# EAGLE schematic PRoMo_Base_DIP v1.1 (EAGLE 7.3.0)
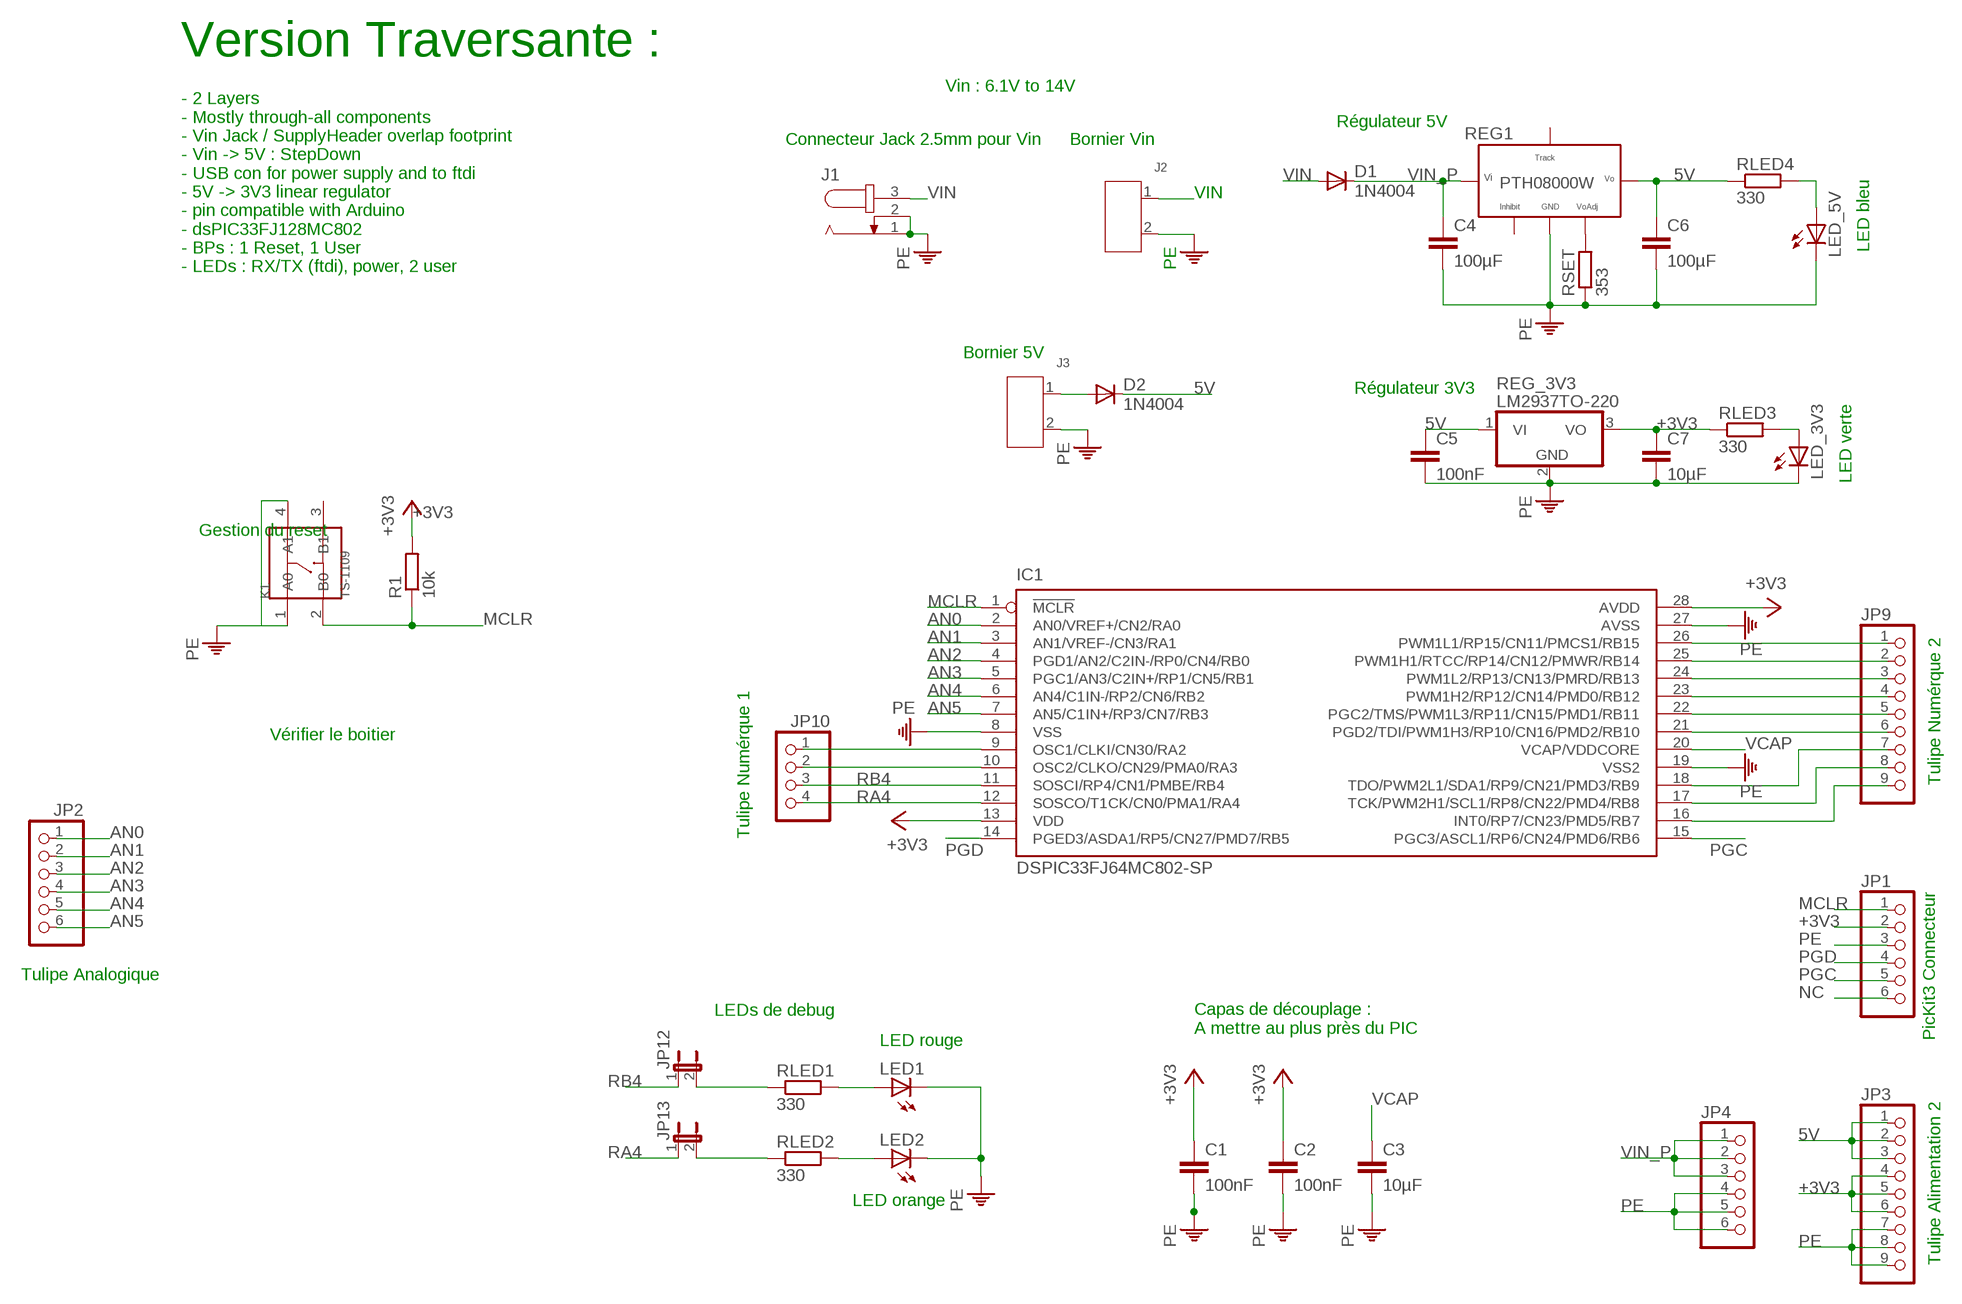
[diagram p0: schematic, sheet 1]

## Parts
C1  100nF  C-EU102-043X133  [C102-043X133]
C2  100nF  C-EU050-035X075  [C050-035X075]
C3  10µF  C-EU050-035X075  [C050-035X075]
C4  100µF  C-EU050-035X075  [C050-035X075]
C5  100nF  C-EU050-035X075  [C050-035X075]
C6  100µF  C-EU050-035X075  [C050-035X075]
C7  10µF  C-EU050-035X075  [C050-035X075]
D1  1N4004  [DO41-10]
D2  1N4004  [DO41-10]
IC1  DSPIC33FJ64MC802-SP  [DIL28-3]
J1  JACK-PLUG1  [SPC4078]
J2  SCREW-TERMINAL-GREEN(2P-5.0)  [H2-5.0-10.5X8.0MM]
J3  SCREW-TERMINAL-GREEN(2P-5.0)  [H2-5.0-10.5X8.0MM]
JP1  PINHD-1X6/90  [1X06/90]
JP2  PINHD-1X6  [1X06]
JP3  PINHD-1X9  [1X09]
JP4  PINHD-1X6  [1X06]
JP9  PINHD-1X9  [1X09]
JP10  PINHD-1X4  [1X04]
JP12  JP1E  [JP1]
JP13  JP1E  [JP1]
K1  TS-1109  DIP-BUTTON-4P  [SW4-6.0X6.0X5.0MM]
LED1  LED3MM  [LED3MM]
LED2  LED3MM  [LED3MM]
LED_3V3  LED3MM  [LED3MM]
LED_5V  LED3MM  [LED3MM]
R1  10k  R-EU_0207/10  [0207/10]
REG1  PTH08000W(EUS)  [TRHOUGH_HOLE_(EUS)]
REG_3V3  LM2937TO-220  [TO220V]
RLED1  330  R-EU_0207/10  [0207/10]
RLED2  330  R-EU_0207/10  [0207/10]
RLED3  330  R-EU_0207/10  [0207/10]
RLED4  330  R-EU_0207/10  [0207/10]
RSET  353  R-EU_0207/10  [0207/10]

## Nets
5V: C5.1 C6.1 D2.C JP3.1 JP3.2 JP3.3 REG1.6 REG_3V3.1(VI) RLED4.1
+3V3: C1.1 C2.1 C7.1 IC1.13(VDD) IC1.28(AVDD) JP1.2 JP3.4 JP3.5 JP3.6 R1.2 REG_3V3.3(VO) RLED3.1
AN0: IC1.2(AN0/VREF+/CN2/RA0) JP2.1
AN1: IC1.3(AN1/VREF-/CN3/RA1) JP2.2
AN2: IC1.4(PGD1/AN2/C2IN-/RP0/CN4/RB0) JP2.3
AN3: IC1.5(PGC1/AN3/C2IN+/RP1/CN5/RB1) JP2.4
AN4: IC1.6(AN4/C1IN-/RP2/CN6/RB2) JP2.5
AN5: IC1.7(AN5/C1IN+/RP3/CN7/RB3) JP2.6
MCLR: IC1.1(!MCLR) JP1.1 K1.2(B0) R1.1
N$1: IC1.26(PWM1L1/RP15/CN11/PMCS1/RB15) JP9.1
N$2: IC1.25(PWM1H1/RTCC/RP14/CN12/PMWR/RB14) JP9.2
N$3: IC1.24(PWM1L2/RP13/CN13/PMRD/RB13) JP9.3
N$4: IC1.23(PWM1H2/RP12/CN14/PMD0/RB12) JP9.4
N$5: IC1.22(PGC2/TMS/PWM1L3/RP11/CN15/PMD1/RB11) JP9.5
N$6: IC1.21(PGD2/TDI/PWM1H3/RP10/CN16/PMD2/RB10) JP9.6
N$7: IC1.18(TDO/PWM2L1/SDA1/RP9/CN21/PMD3/RB9) JP9.7
N$8: IC1.17(TCK/PWM2H1/SCL1/RP8/CN22/PMD4/RB8) JP9.8
N$9: IC1.16(INT0/RP7/CN23/PMD5/RB7) JP9.9
N$10: IC1.9(OSC1/CLKI/CN30/RA2) JP10.1
N$11: IC1.10(OSC2/CLKO/CN29/PMA0/RA3) JP10.2
N$12: LED2.A RLED2.2
N$13: LED1.A RLED1.2
N$14: LED_3V3.A RLED3.2
N$15: JP12.2 RLED1.1
N$16: JP13.2 RLED2.1
N$17: D2.A J3.1
N$20: REG1.5 RSET.2
N$21: LED_5V.A RLED4.2
NC: JP1.6
PE: C1.2 C2.2 C3.2 C4.2 C5.2 C6.2 C7.2 IC1.8(VSS) IC1.19(VSS2) IC1.27(AVSS) J1.1 J1.2 J2.2 J3.2 JP1.3 JP3.7 JP3.8 JP3.9 JP4.4 JP4.5 JP4.6 K1.1(A0) K1.4(A1) LED1.K(C) LED2.K(C) LED_3V3.K(C) LED_5V.K(C) REG1.1 REG_3V3.2(GND) RSET.1
PGC: IC1.15(PGC3/ASCL1/RP6/CN24/PMD6/RB6) JP1.5
PGD: IC1.14(PGED3/ASDA1/RP5/CN27/PMD7/RB5) JP1.4
RA4: IC1.12(SOSCO/T1CK/CN0/PMA1/RA4) JP10.4 JP13.1
RB4: IC1.11(SOSCI/RP4/CN1/PMBE/RB4) JP10.3 JP12.1
VCAP: C3.1 IC1.20(VCAP/VDDCORE)
VIN: D1.A J1.3 J2.1
VIN_P: C4.1 D1.C JP4.1 JP4.2 JP4.3 REG1.3
Unconnected: K1.3(B1) REG1.2 REG1.4

## Notes on the sheet
- Version Traversante :
- - 2 Layers
  - Mostly through-all components
  - Vin Jack / SupplyHeader overlap footprint
  - Vin -> 5V : StepDown
  - USB con for power supply and to ftdi
  - 5V -> 3V3 linear regulator
  - pin compatible with Arduino
  - dsPIC33FJ128MC802
  - BPs : 1 Reset, 1 User
  - LEDs : RX/TX (ftdi), power, 2 user
- Vin : 6.1V to 14V
- Régulateur 5V
- Connecteur Jack 2.5mm pour Vin | Bornier Vin
- LED bleu
- Bornier 5V
- Régulateur 3V3
- LED verte
- Gestion du reset
- Vérifier le boitier
- Tulipe Numérque 2
- Tulipe Numérque 1
- PicKit3 Connecteur
- Tulipe Analogique
- LEDs de debug
- LED rouge
- Capas de découplage :
  A mettre au plus près du PIC
- LED orange
- Tulipe Alimentation 2

## Library data of the parts
C1-C7 = rcl:C-EU: CAPACITOR, European symbol
D1 D2 = diode:1N4004: DIODE general purpose rectifier, 1 A
IC1 = microchip-dspic33fjxxmc:DSPIC33FJ64MC802: High-Performance, 16-bit Digital Signal Controllers - dsPIC33FJ32MC302/304, dsPIC33FJ64MCX02/X04, AND dsPIC33FJ128MCX02/X04 Package: 28-Pin SDIP, SOIC, QFN-S Operating Range: . Up to 40 MIPS operation (at 3.0-3.6V): - Industrial temperature range (-40°C to +85°C) - Extended temperature range (-40°C to +125°C) High-Performance DSC CPU: . Modified Harvard architecture . C compiler optimized instruction set . 16-bit wide data path . 24-bit wide instructions . Linear program memory addressing up to 4M instruction words . Linear data memory addressing up to 64 Kbytes . 83 base instructions: mostly 1 word/1 cycle . Two 40-bit accumulators with rounding and saturation options . Flexible and powerful addressing modes: - Indirect - Modulo - Bit-Reversed . Software stack . 16 x 16 fractional/integer multiply operations . 32/16 and 16/16 divide operations . Single-cycle multiply and accumulate: - Accumulator write back for DSP operations - Dual data fetch . Up to ±16-bit shifts for up to 40-bit data On-Chip Flash and SRAM: . Flash program memory . Data SRAM . Boot, Secure, and General Security for program Flash Direct Memory Access (DMA): . 8-channel hardware DMA . Up to 2 Kbytes dual ported DMA buffer area (DMA RAM) to store data transferred via DMA: - Allows data transfer between RAM and a peripheral while CPU is executing code (no cycle stealing) . Most peripherals support DMA Timers/Capture/Compare/PWM: . Timer/Counters, up to five 16-bit timers: - Can pair up to make two 32-bit timers - One timer runs as a Real-Time Clock with an external 32.768 kHz oscillator - Programmable prescaler . Input Capture (up to four channels): - Capture on up, down or both edges - 16-bit capture input functions - 4-deep FIFO on each capture . Output Compare (up to four channels): - Single or Dual 16-bit Compare mode - 16-bit Glitchless PWM mode . Hardware Real-Time Clock/Calendar (RTCC): - Provides clock, calendar, and alarm functions Interrupt Controller: . 5-cycle latency . 118 interrupt vectors . Up to 49 available interrupt sources . Up to three external interrupts . Seven programmable priority levels . Five processor exceptions Digital I/O: . Peripheral pin Select functionality . Up to 35 programmable digital I/O pins . Wake-up/Interrupt-on-Change for up to 21 pins . Output pins can drive from 3.0V to 3.6V . Up to 5V output with open drain configuration . All digital input pins are 5V tolerant . 4 mA sink on all I/O pins System Management: . Flexible clock options: - External, crystal, resonator, internal RC - Fully integrated Phase-Locked Loop (PLL) - Extremely low jitter PLL . Power-up Timer . Oscillator Start-up Timer/Stabilizer . Watchdog Timer with its own RC oscillator . Fail-Safe Clock Monitor . Reset by multiple sources Power Management: . On-chip 2.5V voltage regulator . Switch between clock sources in real time . Idle, Sleep, and Doze modes with fast wake-up Analog-to-Digital Converters (ADCs): . 10-bit, 1.1 Msps or 12-bit, 500 Ksps conversion: - Two and four simultaneous samples (10-bit ADC) - Up to 13 input channels with auto-scanning - Conversion start can be manual or synchronized with one of four trigger sources - Conversion possible in Sleep mode - ±2 LSb max integral nonlinearity - ±1 LSb max differential nonlinearity Audio Digital-to-Analog Converter (DAC): . 16-bit Dual Channel DAC module . 100 Ksps maximum sampling rate . Second-Order Digital Delta-Sigma Modulator Data Converter Interface (DCI) module: . Codec interface . Supports I2S and AC.97 protocols . Up to 16-bit data words, up to 16 words per frame . 4-word deep TX and RX buffers Comparator Module: . Two analog comparators with programmable input/output configuration CMOS Flash Technology: . Low-power, high-speed Flash technology . Fully static design . 3.3V (±10%) operating voltage . Industrial and Extended temperature . Low power consumption Communication Modules: . 4-wire SPI (up to two modules): - Framing supports I/O interface to simple codecs - Supports 8-bit and 16-bit data - Supports all serial clock formats and sampling modes . I2C?: - Full Multi-Master Slave mode support - 7-bit and 10-bit addressing - Bus collision detection and arbitration - Integrated signal conditioning - Slave address masking . UART (up to two modules): - Interrupt on address bit detect - Interrupt on UART error - Wake-up on Start bit from Sleep mode - 4-character TX and RX FIFO buffers - LIN bus support - IrDA® encoding and decoding in hardware - High-Speed Baud mode - Hardware Flow Control with CTS and RTS . Enhanced CAN (ECAN. module) 2.0B active: - Up to eight transmit and up to 32 receive buffers - 16 receive filters and three masks - Loopback, Listen Only and Listen All - Messages modes for diagnostics and bus monitoring - Wake-up on CAN message - Automatic processing of Remote Transmission Requests - FIFO mode using DMA - DeviceNet. addressing support . Parallel Master Slave Port (PMP/EPSP): - Supports 8-bit or 16-bit data - Supports 16 address lines . Programmable Cyclic Redundancy Check (CRC): - Programmable bit length for the CRC generator polynomial (up to 16-bit length) - 8-deep, 16-bit or 16-deep, 8-bit FIFO for data input
J1 = con-jack:JACK-PLUG: DC POWER JACK Power Jack, DC, Right Angle, Through Hole, Rated 5A at 16VDC, PC Terminals Distributor: Farnell (www.Farnell.de) Drawing: 84N1161.pdf / 84N1162.pdf Manufacturer: SPC Technology (www.spctechnology.com) Type: SPC4077 / SPC 4078; OC_FARNELL: unknown; OC_NEWARK: unknown
J2 J3 = Seeed-OPL-Connector:SCREW-TERMINAL-GREEN(2P-5.0): 320110031
JP1 JP2 JP4 = pinhead:PINHD-1X6: PIN HEADER
JP3 JP9 = pinhead:PINHD-1X9: PIN HEADER
JP10 = pinhead:PINHD-1X4: PIN HEADER
JP12 JP13 = jumper:JP1E: JUMPER
K1 = Seeed-OPL-Button:DIP-BUTTON-4P: 311020024
LED1 LED2 LED_3V3 LED_5V = led:LED: LED OSRAM: - CHIPLED LG R971, LG N971, LY N971, LG Q971, LY Q971, LO R971, LY R971 LH N974, LH R974 LS Q976, LO Q976, LY Q976 LO Q996 - Hyper CHIPLED LW Q18S LB Q993, LB Q99A, LB R99A - SideLED LS A670, LO A670, LY A670, LG A670, LP A670 LB A673, LV A673, LT A673, LW A673 LH A674 LY A675 LS A676, LA A676, LO A676, LY A676, LW A676 LS A679, LY A679, LG A679 - Hyper Micro SIDELED® LS Y876, LA Y876, LO Y876, LY Y876 LT Y87S - SmartLED LW L88C, LW L88S LB L89C, LB L89S, LG L890 LS L89K, LO L89K, LY L89K LS L896, LA L896, LO L896, LY L896 - TOPLED LS T670, LO T670, LY T670, LG T670, LP T670 LSG T670, LSP T670, LSY T670, LOP T670, LYG T670 LG T671, LOG T671, LSG T671 LB T673, LV T673, LT T673, LW T673 LH T674 LS T676, LA T676, LO T676, LY T676, LB T676, LH T676, LSB T676, LW T676 LB T67C, LV T67C, LT T67C, LS T67K, LO T67K, LY T67K, LW E67C LS E67B, LA E67B, LO E67B, LY E67B, LB E67C, LV E67C, LT E67C LW T67C LS T679, LY T679, LG T679 LS T770, LO T770, LY T770, LG T770, LP T770 LB T773, LV T773, LT T773, LW T773 LH T774 LS E675, LA E675, LY E675, LS T675 LS T776, LA T776, LO T776, LY T776, LB T776 LHGB T686 LT T68C, LB T68C - Hyper Mini TOPLED® LB M676 - Mini TOPLED Santana® LG M470 LS M47K, LO M47K, LY M47K Source: http://www.osram.convergy.de LUXEON: - LUMILED® LXK2-PW12-R00, LXK2-PW12-S00, LXK2-PW14-U00, LXK2-PW14-V00 LXK2-PM12-R00, LXK2-PM12-S00, LXK2-PM14-U00 LXK2-PE12-Q00, LXK2-PE12-R00, LXK2-PE12-S00, LXK2-PE14-T00, LXK2-PE14-U00 LXK2-PB12-K00, LXK2-PB12-L00, LXK2-PB12-M00, LXK2-PB14-N00, LXK2-PB14-P00, LXK2-PB14-Q00 LXK2-PR12-L00, LXK2-PR12-M00, LXK2-PR14-Q00, LXK2-PR14-R00 LXK2-PD12-Q00, LXK2-PD12-R00, LXK2-PD12-S00 LXK2-PH12-R00, LXK2-PH12-S00 LXK2-PL12-P00, LXK2-PL12-Q00, LXK2-PL12-R00 Source: www.luxeon.com KINGBRIGHT: KA-3528ASYC Source: www.kingbright.com
R1 RLED1-RLED4 RSET = rcl:R-EU_: RESISTOR, European symbol
REG1 = Perso:PTH08000W(EUS): PTH08000H Alimentation à découpage : Vin : 4.5V to 14V Vout : 0.9V to 5.5V Iout : 2.25A
REG_3V3 = linear:LM2937: LM2937-2.5, LM2937-3.3 400mA and 500mA Voltage Regulators Source: http://cache.national.com/ds/LM/LM2937-2.5.pdf